# Altium schematic sheet POWER STAGE.SchDoc: POWER STAGE
size A3; DocumentNumber: 5; SheetNumber: 5; SheetTotal: 6
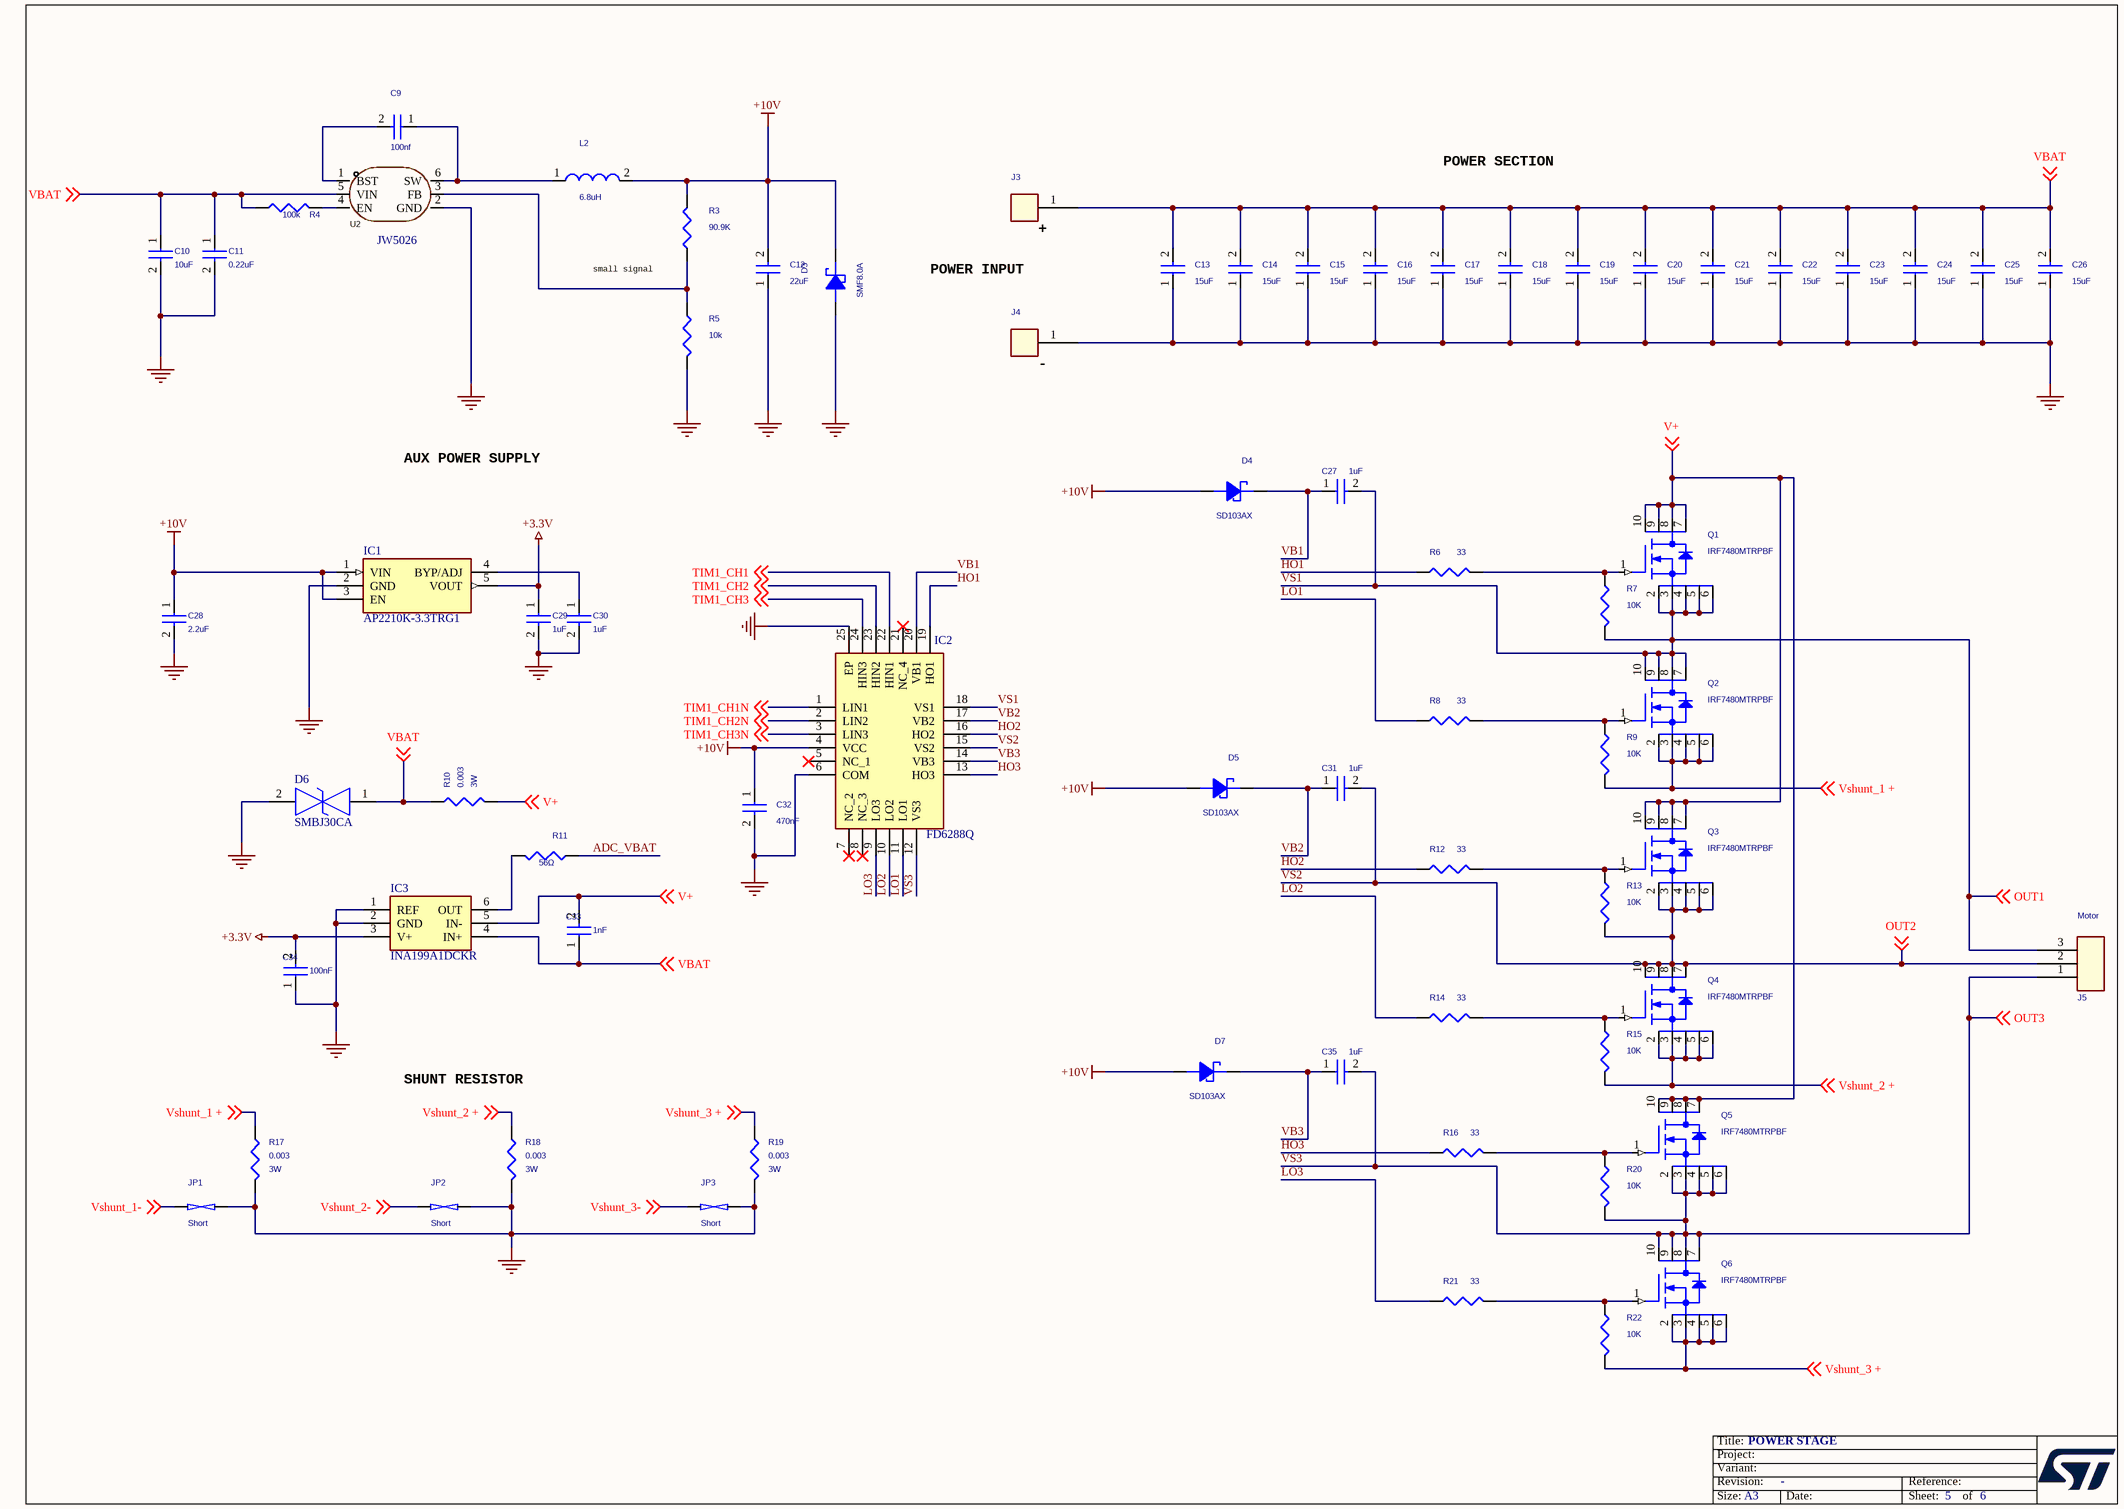
[diagram p0: POWER STAGE.SchDoc]

## Parts
C9  100nf  [C_0402]
C10  10uF  [C_1206]
C11  0.22uF  [C_0603_HD]
C12  22uF  [C_1206]
C13  15uF  [C_0805_HD]
C14  15uF  [C_0805_HD]
C15  15uF  [C_0805_HD]
C16  15uF  [C_0805_HD]
C17  15uF  [C_0805_HD]
C18  15uF  [C_0805_HD]
C19  15uF  [C_0805_HD]
C20  15uF  [C_0805_HD]
C21  15uF  [C_0805_HD]
C22  15uF  [C_0805_HD]
C23  15uF  [C_0805_HD]
C24  15uF  [C_0805_HD]
C25  15uF  [C_0805_HD]
C26  15uF  [C_0805_HD]
C27  1uF  [C_0402]
C28  2.2uF  [C_0402]
C29  1uF  [C_0402]
C30  1uF  [C_0402]
C31  1uF  [C_0402]
C32  470nF  [C_0603_HD]
C33  1nF  [C_0402]
C34  100nF  [C_0402]
C35  1uF  [C_0402]
D3  SMF8.0A  [SODFL3618X108N]
D4  SD103AX  [SODFL1608X70N]
D5  SD103AX  [SODFL1608X70N]
D6  SMBJ30CA  [SMBJ50CA]
D7  SD103AX  [SODFL1608X70N]
IC1  AP2210K-3.3TRG1  [SOT95P280X145-5N]
IC2  FD6288Q  [QFN50P400X400X90-25N-D]
IC3  INA199A1DCKR  [SOT65P210X110-6N]
J3  CON1  [wire1_220s]  (value not drawn)
J4  CON1  [wire1_220s]  (value not drawn)
J5  Motor  [conn_motor_out]
JP1  Short  [SHORT]
JP2  Short  [SHORT]
JP3  Short  [SHORT]
L2  6.8uH  [LQM2MPN1R0NG0L]
Q1  IRF7480MTRPBF  [IRF7480MTRPBF]
Q2  IRF7480MTRPBF  [IRF7480MTRPBF]
Q3  IRF7480MTRPBF  [IRF7480MTRPBF]
Q4  IRF7480MTRPBF  [IRF7480MTRPBF]
Q5  IRF7480MTRPBF  [IRF7480MTRPBF]
Q6  IRF7480MTRPBF  [IRF7480MTRPBF]
R3  90.9K  [R_0402]
R4  100k  [R_0402]
R5  10k  [R_0402]
R6  33  [R_0402]
R7  10K  [R_0402]
R8  33  [R_0402]
R9  10K  [R_0402]
R10  0.003  Rated Power: 3W  [resc635x300x60l193n]
R11  56Ω  [R_0402]
R12  33  [R_0402]
R13  10K  [R_0402]
R14  33  [R_0402]
R15  10K  [R_0402]
R16  33  [R_0402]
R17  0.003  Rated Power: 3W  [resc635x300x60l193n]
R18  0.003  Rated Power: 3W  [resc635x300x60l193n]
R19  0.003  Rated Power: 3W  [resc635x300x60l193n]
R20  10K  [R_0402]
R21  33  [R_0402]
R22  10K  [R_0402]
U2  JW5026  [SOT-23-6_L2.9-W1.6-P0.95-LS2.8-BR]

## Nets
+3.3V: C29.1 C34.2 IC1.5(VOUT) IC3.3(V+)
+10V: C12.2 C28.1 C32.1 D3.C D4.A D5.A D7.A IC1.1(VIN) IC1.3(EN) IC2.4(VCC) L2.2 R3.1
GND: C10.2 C11.2 C12.1 C13.1 C14.1 C15.1 C16.1 C17.1 C18.1 C19.1 C20.1 C21.1 C22.1 C23.1 C24.1 C25.1 C26.1 C28.2 C29.2 C30.2 C32.2 C34.1 D3.A D6.2 IC1.2(GND) IC2.6(COM) IC2.25(EP) IC3.1(REF) IC3.2(GND) J4.1 JP1.2 JP2.2 JP3.2 R5.1 R17.2 R18.2 R19.2 U2.2(GND)
ADC_VBAT: R11.1
HO1: IC2.19(HO1) R6.1
HO2: IC2.16(HO2) R12.1
HO3: IC2.13(HO3) R16.1
LO1: IC2.11(LO1) R8.1
LO2: IC2.10(LO2) R14.1
LO3: IC2.9(LO3) R21.1
TIM1_CH1: IC2.22(HIN1) ; off-sheet TIM1_CH1
TIM1_CH1N: IC2.1(LIN1) ; off-sheet TIM1_CH1N
TIM1_CH2: IC2.23(HIN2) ; off-sheet TIM1_CH2
TIM1_CH2N: IC2.2(LIN2) ; off-sheet TIM1_CH2N
TIM1_CH3: IC2.24(HIN3) ; off-sheet TIM1_CH3
TIM1_CH3N: IC2.3(LIN3) ; off-sheet TIM1_CH3N
V+: C33.2 IC3.5(IN-) Q1.7(D7) Q1.8(D8) Q1.9(D9) Q1.10(D10) Q3.7(D7) Q3.8(D8) Q3.9(D9) Q3.10(D10) Q5.7(D7) Q5.8(D8) Q5.9(D9) Q5.10(D10) R10.2 ; off-sheet V+
VB1: C27.1 D4.C IC2.20(VB1)
VB2: C31.1 D5.C IC2.17(VB2)
VB3: C35.1 D7.C IC2.14(VB3)
VBAT: C10.1 C11.1 C13.2 C14.2 C15.2 C16.2 C17.2 C18.2 C19.2 C20.2 C21.2 C22.2 C23.2 C24.2 C25.2 C26.2 C33.1 D6.1 IC3.4(IN+) J3.1 R4.2 R10.1 U2.5(VIN) ; off-sheet VBAT
VS1: C27.2 IC2.18(VS1) J5.3 Q1.2(S1) Q1.3(S2) Q1.4(S3) Q1.5(S4) Q1.6(S5) Q2.7(D7) Q2.8(D8) Q2.9(D9) Q2.10(D10) R7.2 ; off-sheet OUT1  [also labelled OUT1]
VS2: C31.2 IC2.15(VS2) J5.2 Q3.2(S1) Q3.3(S2) Q3.4(S3) Q3.5(S4) Q3.6(S5) Q4.7(D7) Q4.8(D8) Q4.9(D9) Q4.10(D10) R13.2 ; off-sheet OUT2  [also labelled OUT2]
VS3: C35.2 IC2.12(VS3) J5.1 Q5.2(S1) Q5.3(S2) Q5.4(S3) Q5.5(S4) Q5.6(S5) Q6.7(D7) Q6.8(D8) Q6.9(D9) Q6.10(D10) R20.2 ; off-sheet OUT3  [also labelled OUT3]
Vshunt_1 +: Q2.2(S1) Q2.3(S2) Q2.4(S3) Q2.5(S4) Q2.6(S5) R9.2 R17.1 ; off-sheet Vshunt_1 +
Vshunt_1-: JP1.1 ; off-sheet Vshunt_1-
Vshunt_2 +: Q4.2(S1) Q4.3(S2) Q4.4(S3) Q4.5(S4) Q4.6(S5) R15.2 R18.1 ; off-sheet Vshunt_2 +
Vshunt_2-: JP2.1 ; off-sheet Vshunt_2-
Vshunt_3 +: Q6.2(S1) Q6.3(S2) Q6.4(S3) Q6.5(S4) Q6.6(S5) R19.1 R22.2 ; off-sheet Vshunt_3 +
Vshunt_3-: JP3.1 ; off-sheet Vshunt_3-
NetC9_1: C9.1 L2.1 U2.6(SW)
NetC9_2: C9.2 U2.1(BST)
NetC30_1: C30.1 IC1.4(BYP/ADJ)
NetIC3_6: IC3.6(OUT) R11.2
NetQ1_1: Q1.1(G) R6.2 R7.1
NetQ2_1: Q2.1(G) R8.2 R9.1
NetQ3_1: Q3.1(G) R12.2 R13.1
NetQ4_1: Q4.1(G) R14.2 R15.1
NetQ5_1: Q5.1(G) R16.2 R20.1
NetQ6_1: Q6.1(G) R21.2 R22.1
NetR3_2: R3.2 R5.2 U2.3(FB)
NetR4_1: R4.1 U2.4(EN)

Not connected (* = marked no-connect by the designer): IC2 5(NC_1)* 7(NC_2)* 8(NC_3)* 21(NC_4)*

## Notes on the sheet
- POWER SECTION
- (near J3) +
- small signal
- POWER INPUT
- (near J4) -
- AUX POWER SUPPLY
- (near R18) SHUNT RESISTOR
- Title:
- Project:
- Size:
- Revision:
- Variant:
- A3
- Date:
- Reference:
- Sheet:
- of

## Library data of the parts
C9 = CAP_Dup1: CAP CER 3900PF 16V X7R 0402; Manufacturer PN: C0402C392K4RAC7867; Manufacturer: KEMET; PART_NUMBER: TMP-419; CLASS: DISCRETE; Tolerance: 10%; Dielectric Type: Capacitors; Rated Voltage: 16V; Temperature Coefficient: X7R; Package Size: 0402 (1005 Metric)
C10 = CAP_Dup1: CAP CER 10UF 50V X7R 1206; Manufacturer PN: CL31B106KBHNNNE; Manufacturer: Samsung Electro-Mechanics America, Inc.; PART_NUMBER: CAP-00000016; CLASS: DISCRETE; Tolerance: 10%; Dielectric Type: Capacitors; Rated Voltage: 50V; Temperature Coefficient: X7R; Package Size: 1206 (3216 Metric)
C11 = CAP_Dup1: CAP CER 0.22UF 50V X7R 0603; Manufacturer PN: CGA3E3X7R1H224K080AD; Manufacturer: TDK Corporation; PART_NUMBER: TMP-138; CLASS: DISCRETE; Tolerance: 10%; Dielectric Type: Capacitors; Rated Voltage: 50V; Temperature Coefficient: X7R; Package Size: 0603 (1608 Metric); ALT_SYMBOLS: c_0603_hd
C12 = CAP_Dup1: CAP CER 22UF 25V X5R 1206; Manufacturer PN: GRT31CR61E226ME01L; Manufacturer: Murata Electronics North America; PART_NUMBER: TMP-421; CLASS: DISCRETE; Tolerance: 20%; Dielectric Type: Capacitors; Rated Voltage: 25V; Temperature Coefficient: X5R; Package Size: 1206 (3216 Metric)
C13-C26 = CAP_Dup1: CAP CER 15UF 35V X5R 0805; PART_NUMBER: TMP-773; Manufacturer: TDK Corporation; Manufacturer PN: C2012X5R1V156M125AC; Dielectric Type: Capacitors; Tolerance: 20%; CLASS: DISCRETE; ALT_SYMBOLS: C_0805_hd; Package Size: 0805 (2012 Metric); Temperature Coefficient: X5R; Rated Voltage: 35V
C27 C31 C33-C35 = CAP: CAP CER 10PF 10V C0G/NP0 0402; Manufacturer PN: 885012005007; Manufacturer: Wurth Electronics Inc.; PART_NUMBER: TMP-395; CLASS: DISCRETE; Tolerance: 5%; Temperature Coefficient: C0G, NP0; Dielectric Type: Capacitors; Rated Voltage: 10V; Package Size: 0402 (1005 Metric)
C28 = CAP_Dup1: CAP CER 2.2UF 10V X5R 0402; PART_NUMBER: TMP-449; Manufacturer: Wurth Electronics Inc.; Manufacturer PN: 885012105013; Dielectric Type: Capacitors; Tolerance: 20%; CLASS: DISCRETE; Package Size: 0402 (1005 Metric); Temperature Coefficient: X5R; Rated Voltage: 10V
C29 C30 = CAP_Dup1: CAP CER 1UF 25V X5R 0402; Manufacturer PN: GRM155R61E105KA12D; Manufacturer: Murata Electronics North America; PART_NUMBER: CAP-00000006; CLASS: DISCRETE; Tolerance: 10%; Dielectric Type: Capacitors; Rated Voltage: 25V; Temperature Coefficient: X5R; Package Size: 0402 (1005 Metric)
C32 = CAP_Dup1: CAP CER 0.47UF 25V X7R 0603; PART_NUMBER: TMP-428; Manufacturer: Wurth Electronics Inc.; Manufacturer PN: 885012206075; Dielectric Type: Capacitors; Tolerance: 10%; CLASS: DISCRETE; ALT_SYMBOLS: c_0603_hd; Package Size: 0603 (1608 Metric); Temperature Coefficient: X7R; Rated Voltage: 25V
D3 = DIODE_SCHOTTKY_0: DIODE SCHOTTKY 20V 1A STMITEFLAT; PART_NUMBER: TMP-380; Manufacturer: STMicroelectronics; Manufacturer PN: STPS1L20MF; Rated Voltage: 430mV @ 1A; CLASS: DISCRETE; Package Size: DO-222AA
D4 D5 D7 = DIODE_SCHOTTKY_0: DIODE SCHOTTKY 20V 1A STMITEFLAT; Manufacturer PN: STPS1L20MF; Manufacturer: STMicroelectronics; PART_NUMBER: TMP-380; CLASS: DISCRETE; Rated Voltage: 430mV @ 1A; Package Size: DO-222AA
D6 = SMBJ30CA: TVS Diode (Bi-directional); Manufacturer_Name: STMicroelectronics; Datasheet Link: http://www.st.com/web/en/resource/technical/document/datasheet/CD00001366.pdf; Height: 2.65mm; Manufacturer_Part_Number: SMBJ30CA
IC1 = AP2210K-3.3TRG1: Integrated Circuit; Manufacturer_Name: Diodes Inc.; Datasheet Link: https://datasheet.datasheetarchive.com/originals/distributors/Datasheets_SAMA/11c7b06ddc65ce3f1395e62eca004054.pdf; Height: 1.45mm; Manufacturer_Part_Number: AP2210K-3.3TRG1; Mouser Part Number: 621-AP2210K-3.3TRG1; Mouser Price/Stock: https://www.mouser.co.uk/ProductDetail/Diodes-Incorporated/AP2210K-3.3TRG1?qs=x6A8l6qLYDB6QE%252Bu0QG50A%3D%3D; Arrow Part Number: AP2210K-3.3TRG1; Arrow Price/Stock: https://www.arrow.com/en/products/ap2210k-3.3trg1/diodes-incorporated?region=asia
IC2 = FD6288Q: Integrated Circuit; Manufacturer_Name: Fortior Tech; Datasheet Link: https://datasheet.lcsc.com/szlcsc/1811131655_Fortior-Tech-FD6288Q_C328453.pdf; Height: 0.9mm; Manufacturer_Part_Number: FD6288Q
IC3 = INA199A1DCKR: Integrated Circuit; Manufacturer_Name: Texas Instruments; Datasheet Link: http://www.ti.com/lit/ds/symlink/ina199.pdf; Height: 1.1mm; Manufacturer_Part_Number: INA199A1DCKR; Mouser Part Number: 595-INA199A1DCKR; Mouser Price/Stock: https://www.mouser.co.uk/ProductDetail/Texas-Instruments/INA199A1DCKR?qs=v3hU%2FV0XOahkyIKIBScY5Q%3D%3D; Arrow Part Number: INA199A1DCKR; Arrow Price/Stock: https://www.arrow.com/en/products/ina199a1dckr/texas-instruments?region=nac
J3 J4 = CON1: SOLDER PADS
J5 = CON3: SOLDER PADS
JP1-JP3 = SHORT: 2 PIN SHORTED TO CONNECT DIFFERENT NETS; PART_NUMBER: TMP-442; CLASS: DISCRETE
L2 = IND: Fixed Inductors LPS4018 Low Profile 33uH 0.8A 20% SMD; Manufacturer PN: LPS4018-333MRB; Manufacturer: Coilcraft; PART_NUMBER: TMP-377; CLASS: DISCRETE; Tolerance: 20%; Package Size: 3.9x3.9x1.7
Q1-Q6 = MOSFET_N: N-channel 60 V, 1.9 mO typ., 120 A STripFET™ F7; PART_NUMBER: TMP-772; Manufacturer: STMicroelectronics; Manufacturer PN: STL180N6F7; CLASS: DISCRETE; Rated Voltage: 60V; Package Size: PowerFLAT 5x6
R3 = RES: RES SMD 4.7K OHM 1% 1/16W 0402; Manufacturer PN: CRG0402F4K7; Manufacturer: TE Connectivity Passive Product; PART_NUMBER: TMP-403; CLASS: DISCRETE; Rated Power: 0.063W, 1/16W; Temperature Coefficient: 100ppm/C; Tolerance: 1%; Package Size: 0402 (1005 Metric)
R4 = RES: RES SMD 34.8K OHM 1% 1/16W 0402; Manufacturer PN: RC0402FR-0734K8L; Manufacturer: Yageo; PART_NUMBER: TMP-415; CLASS: DISCRETE; Rated Power: 0.063W, 1/16W; Temperature Coefficient: 100ppm/C; Tolerance: 1%; Package Size: 0402 (1005 Metric)
R5 = RES: RES SMD 300 OHM 1% 1/16W 0402; PART_NUMBER: TMP-418; Manufacturer: Yageo; Manufacturer PN: RC0402FR-07300RL; Temperature Coefficient: 100ppm/C; Rated Power: 0.063W, 1/16W; CLASS: DISCRETE; Package Size: 0402 (1005 Metric); Tolerance: 1%
R6 R8 R12 R14 R16 R21 = RES: RES SMD 33 OHM 1% 1/16W 0402; PART_NUMBER: TMP-441; Manufacturer: Yageo; Manufacturer PN: RC0402FR-07120RL; Temperature Coefficient: 100ppm/C; Rated Power: 0.063W, 1/16W; CLASS: DISCRETE; Package Size: 0402 (1005 Metric); Tolerance: 1%
R7 R9 R13 R15 = RES: RES SMD 10K OHM 1% 1/16W 0402; Manufacturer PN: RC0402FR-0710KL; Manufacturer: Yageo; PART_NUMBER: TMP-396; CLASS: DISCRETE; Rated Power: 0.063W, 1/16W; Temperature Coefficient: 100ppm/C; Tolerance: 1%; Package Size: 0402 (1005 Metric)
R10 R18 = RES: RES 0.003 OHM 1% 3W 2512; Manufacturer PN: TLR3A30DR003FTDG; Manufacturer: TE Connectivity Passive Product; PART_NUMBER: TMP-766; CLASS: DISCRETE; Temperature Coefficient: 50ppm/C; Tolerance: 1%; Package Size: 2512 (6432 Metric)
R11 = RES: RES SMD 30.9K OHM 1% 1/10W 0402; PART_NUMBER: TMP-448; Manufacturer: Panasonic Electronic Components; Manufacturer PN: ERJ-2RKF3092X; Temperature Coefficient: 100ppm/C; Rated Power: 0.1W, 1/10W; CLASS: DISCRETE; Package Size: 0402 (1005 Metric); Tolerance: 1%
R17 R19 = RES: RES 0.003 OHM 1% 3W 2512; PART_NUMBER: TMP-766; Manufacturer: TE Connectivity Passive Product; Manufacturer PN: TLR3A30DR003FTDG; Temperature Coefficient: 50ppm/C; CLASS: DISCRETE; Package Size: 2512 (6432 Metric); Tolerance: 1%
R20 R22 = RES: RES SMD 10K OHM 1% 1/16W 0402; PART_NUMBER: TMP-396; Manufacturer: Yageo; Manufacturer PN: RC0402FR-0710KL; Temperature Coefficient: 100ppm/C; Rated Power: 0.063W, 1/16W; CLASS: DISCRETE; Package Size: 0402 (1005 Metric); Tolerance: 1%
U2 = JW5026: Manufacturer: Joulwatt(杰华特); Add into BOM: yes; Function: 降压型; Name: JW5026; Symbol: JW5026; Device: JW5026; LCSC Part Name: 降压型; Supplier Part: C185109; Manufacturer Part: JW5026; Supplier Footprint: SOT-23-6; JLCPCB Part Class: Extended Part; Datasheet: https://atta.szlcsc.com/upload/public/pdf/source/20180404/C185109_F816213DAA4C443FF7F4B914D7806D86.pdf; Supplier: LCSC; Convert to PCB: yes; Synchronous Rectification: -; Number of Outputs: -; Topology: -; Input Voltage: -; Output Current (Max): -; Switching Frequency: -